# Altium schematic sheet jtag.SchDoc
size A
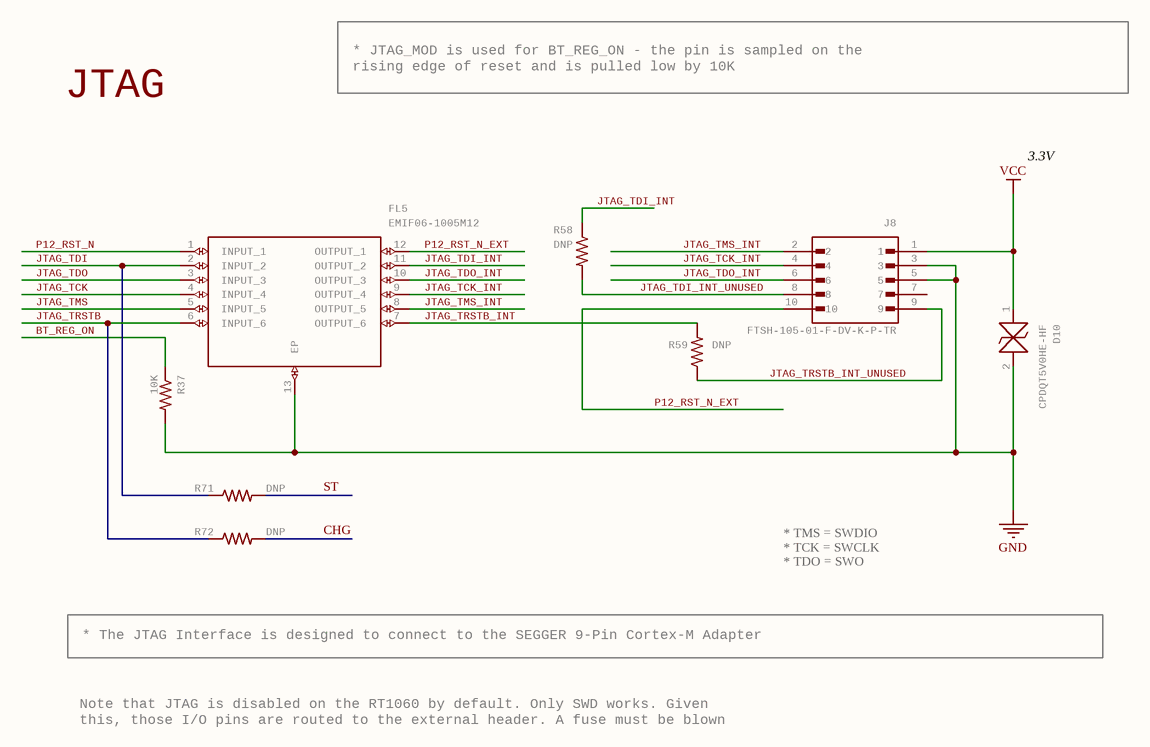
[diagram p0: jtag.SchDoc]

## Parts
D10  CPDQT5V0HE-HF  [CPDQT5V0HEHF]
FL5  EMIF06-1005M12  [SON40P150X250X65-13N]
J8  FTSH-105-01-F-DV-K-P-TR  [CNC_3221-10-0300-00]
R37  10K  [0402-RES]
R58  DNP  [0402-RES]
R59  DNP  [0402-RES]
R71  DNP  [0402-RES]
R72  DNP  [0402-RES]

## Nets
GND: D10.2 FL5.13(EP) J8.3 J8.5 R37.2
VCC: D10.1 J8.1
BT_REG_ON: R37.1
CHG: R72.2
JTAG_TCK: FL5.4(INPUT_4)
JTAG_TCK_INT: FL5.9(OUTPUT_4) J8.4
JTAG_TDI: FL5.2(INPUT_2) R71.1
JTAG_TDI_INT: FL5.11(OUTPUT_2) R58.1
JTAG_TDI_INT_UNUSED: J8.8 R58.2
JTAG_TDO: FL5.3(INPUT_3)
JTAG_TDO_INT: FL5.10(OUTPUT_3) J8.6
JTAG_TMS: FL5.5(INPUT_5)
JTAG_TMS_INT: FL5.8(OUTPUT_5) J8.2
JTAG_TRSTB: FL5.6(INPUT_6) R72.1
JTAG_TRSTB_INT: FL5.7(OUTPUT_6) R59.2
JTAG_TRSTB_INT_UNUSED: J8.9 R59.1
P12_RST_N: FL5.1(INPUT_1)
P12_RST_N_EXT: FL5.12(OUTPUT_1) J8.10
ST: R71.2

Not connected (* = marked no-connect by the designer): J8 7

## Notes on the sheet
- * JTAG_MOD is used for BT_REG_ON - the pin is sampled on the
  rising edge of reset and is pulled low by 10K
- JTAG
- 3.3V
- * The JTAG Interface is designed to connect to the SEGGER 9-Pin Cortex-M Adapter
- * TMS = SWDIO
  * TCK = SWCLK
  * TDO = SWO
- Note that JTAG is disabled on the RT1060 by default. Only SWD works. Given this, those I/O pins are routed to the external header. A fuse must be blown to switch to JTAG which disables SWD

## Library data of the parts
D10 = CPDQT5V0HE-HF: ESD Suppressors / TVS Diodes DIODE ESD 5VWM 65W 0402/SOD-923F   Source:  Datasheet; MANUFACTURER_NAME: Comchip Technology; GateName_1: G$1; SymbolName_1: CPDQT5V0HE-HF; LibraryName: CPDQT5V0HE-HF; DeviceSetName: CPDQT5V0HE-HF; HEIGHT: 0.42mm; MANUFACTURER_PART_NUMBER: CPDQT5V0HE-HF; MOUSER_PART_NUMBER: MOUSER_PART_NUMBER; MOUSER_PRICE-STOCK: MOUSER_PRICE-STOCK; MPN: CPDQT5V0HE-HF; Part Number: CPDQT5V0HE-HF
FL5 = EMIF06-1005M12: EMI Filter Circuits 6lin lw cpcitnc EMI 45pF -35db @ 900MHz   Source:  Datasheet; MANUFACTURER_NAME: STMicroelectronics; GateName_1: G$1; SymbolName_1: EMIF06-1005M12; LibraryName: EMIF06-1005M12; DeviceSetName: EMIF06-1005M12; HEIGHT: 0.65mm; MANUFACTURER_PART_NUMBER: EMIF06-1005M12; MOUSER_PART_NUMBER: 511-EMIF06-1005M12; MOUSER_PRICE-STOCK: https://www.mouser.co.uk/ProductDetail/STMicroelectronics/EMIF06-1005M12?qs=VJaATVMq%252BXo0u09ZqtQg3A%3D%3D; MPN: EMIF06-1005M12; Part Number: EMIF06-1005M12
J8 = 3221-10-0300-00: Check availability; GateName_1: G$1; MF: CNC Tech; SymbolName_1: 3221-10-0300-00; LibraryName: 3221-10-0300-00; DeviceSetName: 3221-10-0300-00; AVAILABILITY: In Stock; MP: FTSH-105-01-F-DV-K-P-TR; MPN: FTSH-105-01-F-DV-K-P-TR; PACKAGE: None; PRICE: None; PURCHASE-URL: https://pricing.snapeda.com/search/part/3221-10-0300-00/?ref=eda; Part Number: FTSH-105-01-F-DV-K-P-TR
R37 = RESISTOR0402-RES: ResistorBasic schematic elements and footprints for 0603, 1206, and PTH resistors.; MPN: AC0402FR-1310KL; GateName_1: G$1; SymbolName_1: RESISTOR; DeviceName: 0402-RES; LibraryName: sfe; DeviceSetName: RESISTOR; Part Number: AC0402FR-1310KL
R58 R59 R71 R72 = RESISTOR0402-RES: ResistorBasic schematic elements and footprints for 0603, 1206, and PTH resistors.; GateName_1: G$1; SymbolName_1: RESISTOR; DeviceName: 0402-RES; LibraryName: sfe; DeviceSetName: RESISTOR; MPN: DNP; Part Number: DNP